# Altium schematic sheet dl380_fan_mod.SchDoc: DL380 Fan Converter
size A4; Author: Bartosz Kazmierczak; Organization: Bartosz Kaźmierczak; Address1: https://github.com/Bart97; Address2: /dl380_fan_mod; DocumentNumber: 42; Revision: A; SheetNumber: 1; SheetTotal: 1
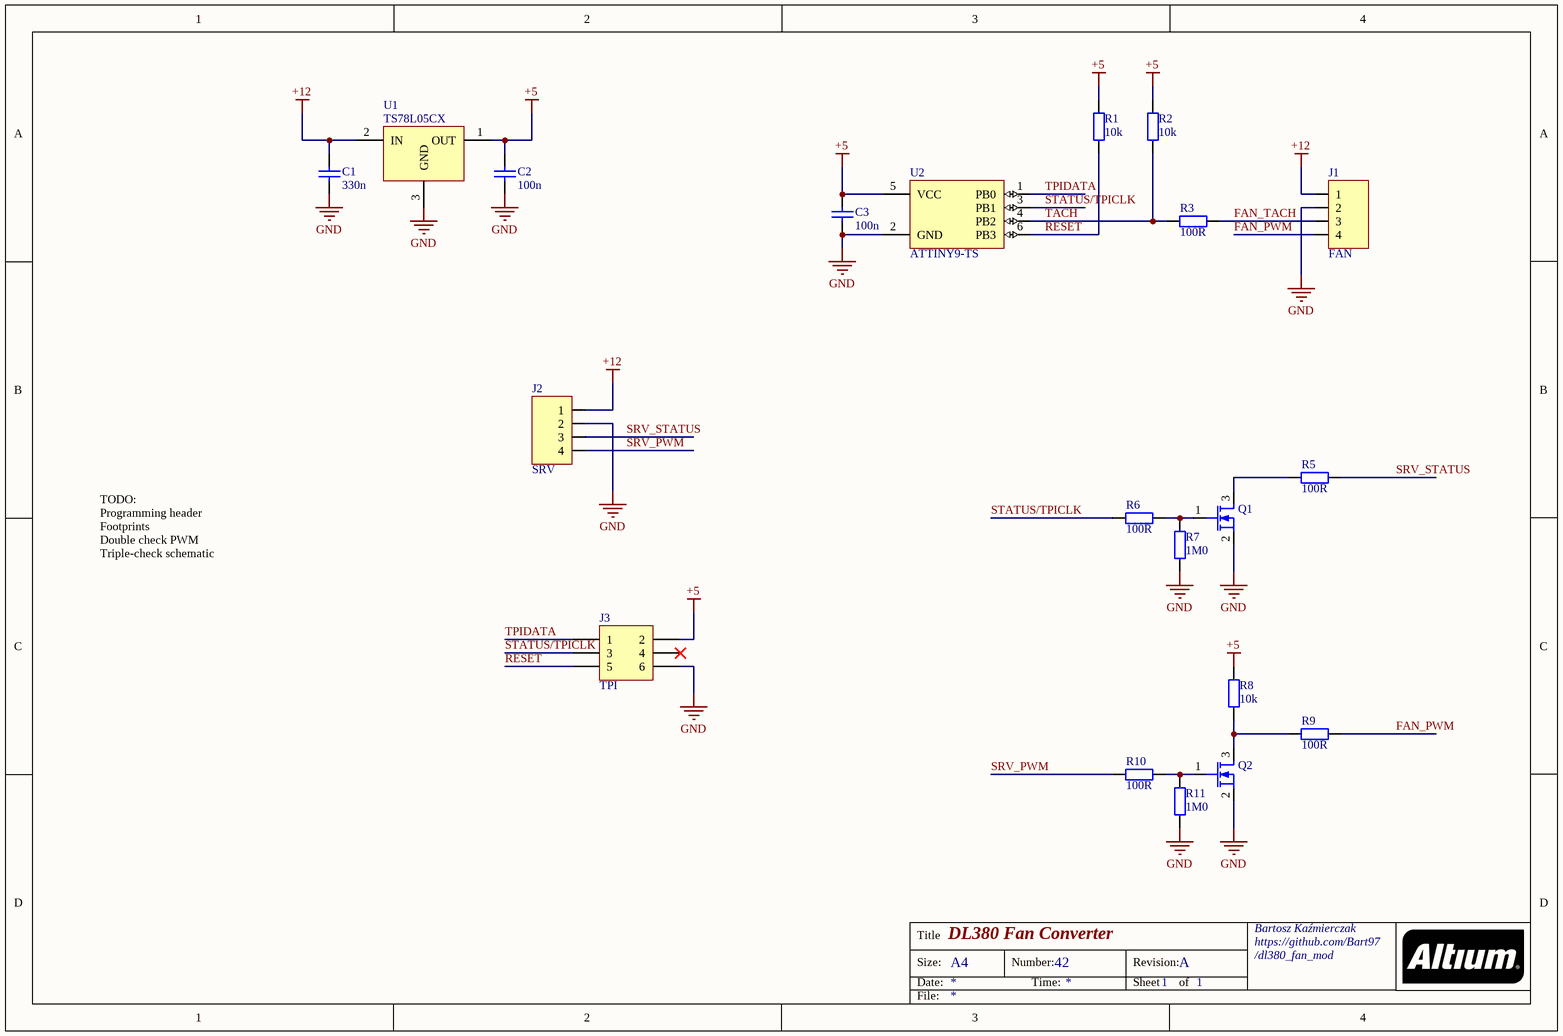
[diagram p0: dl380_fan_mod.SchDoc]

## Parts
C1  330n  [CAPC320X160X180L55N]
C2  100n  [CAPC1608X08N]
C3  100n  [CAPC1608X08N]
J1  FAN  [4x_PAD_4x1]
J2  SRV  [4x_PAD_4x1]
J3  TPI  [HDRV6W40P127_3X2_381X340H570]
Q1  MOSFET-N  [SOT23-3P95_230X110L30X43N]  (value not drawn)
Q2  MOSFET-N  [SOT23-3P95_230X110L30X43N]  (value not drawn)
R1  10k  [RESC1608X06N]
R2  10k  [RESC1608X06N]
R3  100R  [RESC1608X06N]
R5  100R  [RESC1608X06N]
R6  100R  [RESC1608X06N]
R7  1M0  [RESC1608X06N]
R8  10k  [RESC1608X06N]
R9  100R  [RESC1608X06N]
R10  100R  [RESC1608X06N]
R11  1M0  [RESC1608X06N]
U1  TS78L05CX  [SOT23-3P95_275X135L45X40N]
U2  ATTINY9-TS  [SOT23-6P95_280X145L42X40N]

## Nets
+5: C2.2 C3.2 J3.2 R1.2 R2.2 R8.1 U1.1(OUT) U2.5(VCC)
+12: C1.2 J1.1 J2.1 U1.2(IN)
GND: C1.1 C2.1 C3.1 J1.2 J2.2 J3.6 Q1.2(S) Q2.2(S) R7.1 R11.1 U1.3(GND) U2.2(GND)
FAN_PWM: J1.4 R9.1
FAN_TACH: J1.3 R3.1
RESET: J3.5 R1.1 U2.6(PB3)
SRV_PWM: J2.4 R10.2
SRV_STATUS: J2.3 R5.1
STATUS/TPICLK: J3.3 R6.2 U2.3(PB1)
TACH: R2.1 R3.2 U2.4(PB2)
TPIDATA: J3.1 U2.1(PB0)
NetQ1_1: Q1.1(G) R6.1 R7.2
NetQ1_3: Q1.3(D) R5.2
NetQ2_1: Q2.1(G) R10.1 R11.2
NetQ2_3: Q2.3(D) R8.2 R9.2

Not connected (* = marked no-connect by the designer): J3 4*

## Notes on the sheet
- TODO:
  Programming header
  Footprints
  Double check PWM
  Triple-check schematic
- Title
- Size:
- Date:
- A4
- Number:
- Time:
- Revision:
- Sheet
- of
- File:

## Library data of the parts
C1 = cap_330n_1206: Capacitor SMD 1206, 330n; Reference: cap_330n_1206; Value: 330n
C2 C3 = cap_100n_0603: Capacitor SMD 0603, 100n; Reference: cap_100n_0603; Value: 100n
J1 J2 = 4x_PAD_4x1: Reference: 4x_PAD_4x1
J3 = HDR_2x3_50mil: 2x3 Pin Header, 50mil, 1.27mm, THT; Reference: HDR_2x3_50mil; Pin Count: 6
Q1 Q2 = PMV30UN2: 20V N-channel MOSFET, SOT-23; Manufacturer: Nexperia; Reference: PMV30UN2; Part Number: PMV30UN2
R1 R2 R8 = res_10k_0603: Resistor, SMD 0603, 10k, 5%; Value: 10k; Reference: res_10k_0603; Tolerance: 5%
R3 R5 R6 R9 R10 = res_100R_0603: Resistor, SMD 0603, 100R, 5%; Value: 100R; Reference: res_100R_0603; Tolerance: 5%
R7 R11 = res_1M0_0603: Resistor, SMD 0603, 1M0, 5%; Value: 1M0; Reference: res_1M0_0603; Tolerance: 5%
U1 = TS78L05CX: 5V, 100mA Positive Voltage Regulator; Manufacturer: Taiwan Semiconductor; Reference: TS78L05CX; Part Number: TS78L05CX; Output Voltage: 5V
U2 = ATTINY9-TS: Low Power 8-bit ARM Microcontroller with 4 GPIO pins in SOT23-6 package; Manufacturer: Microchip; Reference: ATTINY9-TS; Part Number: ATTINY9-TS